# Altium schematic sheet Low Pass Filter.SchDoc
size OrCAD A
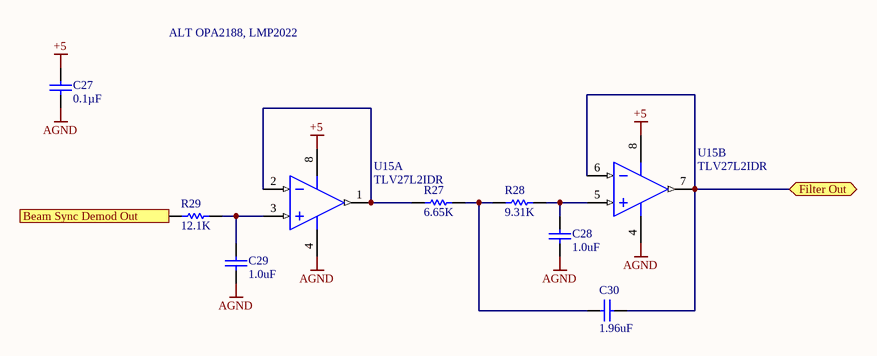
[diagram p0: Low Pass Filter.SchDoc]

## Parts
C27  Capacitance: 0.1µF  [CAPC0805(2012)145_N]  (hidden comment: CAP CER 0.1UF 25V X7R 0805)
C28  1.0uF  [CAPC0805(2012)75_L]
C29  1.0uF  [CAPC0805(2012)75_L]
C30  1.96uF  [CAPC0805(2012)75_L]
R27  6.65K  [RESC0805(2012)_L]
R28  9.31K  [RESC0805(2012)_L]
R29  12.1K  [RESC0805(2012)_L]
U15  TLV27L2IDR  [D0008A_N]  (parts A,B of 2)

## Ports
Beam Sync Demod Out (out), Filter Out

## Nets
+5: C27.2 U15.8(VDD)
AGND: C27.1 C28.1 C29.1 U15.4(GND)
Beam Sync Demod Out: R29.2 ; port Beam Sync Demod Out
Filter Out: C30.1 U15.6(IN2-) U15.7(OUT2) ; port Filter Out
NetC28_2: C28.2 R28.1 U15.5(IN2+)
NetC29_2: C29.2 R29.1 U15.3(IN1+)
NetC30_2: C30.2 R27.1 R28.2
NetR27_2: R27.2 U15.1(OUT1) U15.2(IN1-)

## Notes on the sheet
- ALT OPA2188, LMP2022
- Title
- Size:
- Date:
- Orcad A
- Number:
- Time:
- Revision:
- Sheet
- of
- ZLS Corporation
- 7801 North Lamar Blvd.
- Suite E-184
- Austin, Texas 78752  USA
- (512) 453-0288
- File:

## Library data of the parts
C27 = CMP-1036-04795-1: Manufacturer: Murata Electronics North America; Manufacturer Part Number: GRM21BR71E104KA01L; Tolerance: ±10%; Supplier 1: Digi-Key; Supplier Part Number 1: 490-1673-6-ND; RoHS: RoHS Compliant; Category: Capacitors; Stock 1: 891652; Pricing 1: 1=0.2, 10=0.145, 100=0.0683, 500=0.04788, 1000=0.03964 (USD); Packaging: Digi-Reel®; Part Status: Active; Voltage - Rated: 25V; Temperature Coefficient: X7R; Operating Temperature: -55°C ~ 125°C; Features: -; Ratings: -; Applications: General Purpose; Mounting Type: Surface Mount, MLCC; Package / Case: 0805 (2012 Metric); Size / Dimension: 0.079" L x 0.049" W (2.00mm x 1.25mm); Height - Seated (Max): -; Thickness (Max): 0.053" (1.35mm); Lead Spacing: -; Lead Style: -; ComponentLink1URL: http://www.murata.com/~/media/webrenewal/support/library/catalog/products/capacitor/mlcc/c02e.ashx; ComponentLink1Description: http://www.murata.com/~/media/webrenewal/support/library/catalog/products/capacitor/mlcc/c02e.ashx
C28 = CMP-1036-02117-1: CAP CER 1.0UF 25V X5R 0805
C29 = CMP-1036-02117-1: CAP CER 1.0UF 25V X5R 0805; Tolerance: ±20%; Voltage - Rated: 25V; Thickness (Max): 0.057" (1.45mm)
C30 = CMP-1036-02117-1: CAP CER 1.96UF 25V X5R 0805
R27 = CMP-1013-00215-1: RES SMD 6.65K OHM 1% 1/8W 0805
R28 = CMP-1013-00215-1: RES SMD 9.31K OHM 1% 1/8W 0805
R29 = CMP-1013-00215-1: RES SMD 12.1K OHM 1% 1/8W 0805
U15 = CMP-0272-02980-3: 11 uA/Ch, 160 kHz, RR-Out Dual Operational Amplifier, 2.7 to 16 V, -40 to 125 degC, 8-pin SOIC (D8), Green (RoHS & no Sb/Br); Manufacturer: Texas Instruments; Total Supply Voltage(Min)(+5V is 5, +/-5V is 10): 2.7; Rating: Catalog; Vio (25C)(Max)(mV): 5; Total Supply Voltage(Max)(+5V is 5, +/-5V is 10): 16; Slew Rate(Typ)(V/us): 0.06; Iq per channel(Max)(mA): 0.011; Packing: LARGE T&R; Sub Family: Low Power Amp (<=500uA), Low Supply Voltage Amplifier (<=2.7V), Precision Amplifier; CMRR(Min)(dB): 71; Offset Drift(Typ)(uV/C): 1.1; Number of Channels: 2; GBW(Typ)(MHz): 0.16; IIB(Max)(pA): 60; PartNumber: TLV27L2IDR; Mounting Technology: Surface Mount; PackageVersion: 4040047-3/M, 06/2011; ComponentLink1Description: Manufacturer URL; Code_JEDEC: MS-012; ComponentLink3URL: http://www.ti.com/litv/pdf/msoi002j; DatasheetVersion: SLOS378B; PackageReference: D0008A; ComponentLink2Description: Datasheet; ComponentLink2URL: http://www.ti.com/lit/ds/symlink/tlv27l2.pdf; ComponentLink3Description: Package Specification; Eco-Plan: Green (RoHS & no Sb/Br); PackageDescription: 8-Pin Plastic Small Outline, Body 4.9 x 3.9 mm, Pitch 1.27 mm; ComponentLink1URL: http://www.ti.com/; PartId: 1